# Altium project 一体机V5.PrjPcb (part 1 of 4)
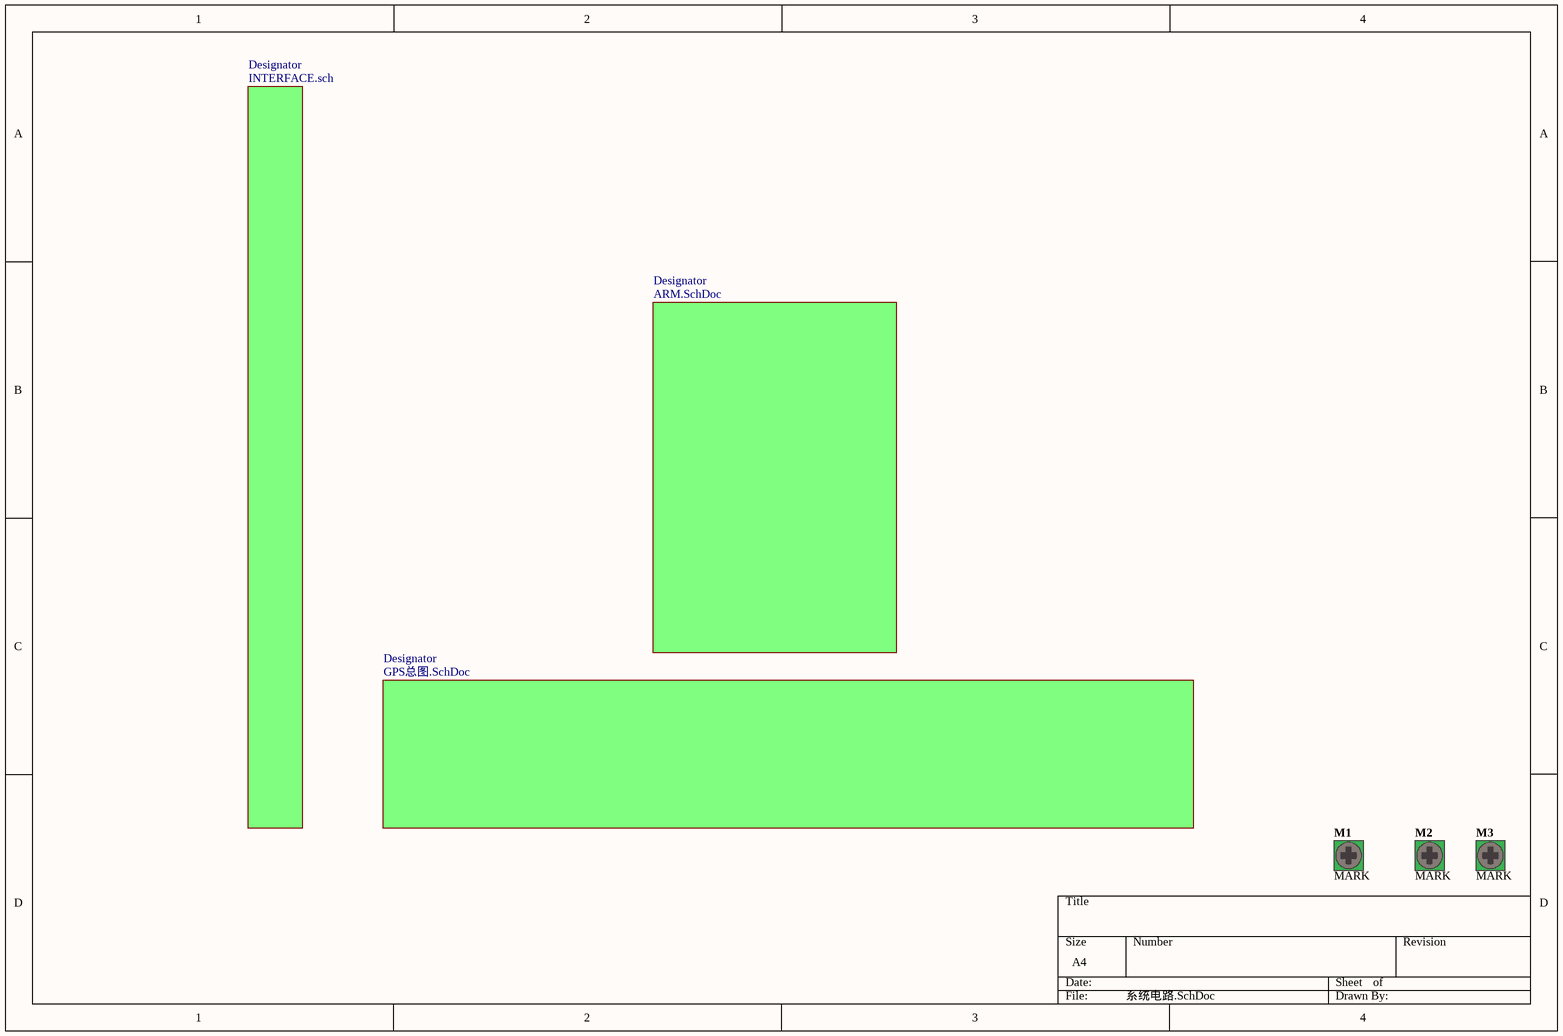
[diagram p0: 系统电路.SchDoc]
24 sheets, 290 parts. Net scope: global (net labels, ports and power ports of the same name join across sheets).
Board file: PCB5.PcbDoc
Sheets:
  系统电路.SchDoc
    Designator = ARM.SchDoc
      Designator = 电源ARM_LP5951_1.3.SchDoc
      Designator = 06-JTAG.SchDoc
      Designator = 05-RESET.SchDoc
      Designator = 电源ARM_VRD240512MP-8W.SchDoc
      Designator = 外围电路.SchDoc
        Designator = 12-LCD背光驱动_BIT3251.SchDoc
        Designator = 04-蜂鸣器.SchDoc
        Designator = 05-RTC.SchDoc
        Designator = 03-指示灯.SchDoc
        Designator = 07-LVDS.SchDoc
        Designator = 01-USB Device.SchDoc
        Designator = 06-Key.SchDoc
        Designator = 08-IIC.SchDoc
        Designator = 11-SPI.SchDoc
    Designator = GPS总图.SchDoc
      Designator = 01-MSP430.SchDoc
      Designator = 02-GPRS.SchDoc
      Designator = 03-GPS.SchDoc
      Designator = BQ24073_锂电池充电.SchDoc
      Designator = 开盒检测_MAX931.SchDoc
      Designator = MAIN POWER.SchDoc
      Designator = 上电唤醒_Max706.SchDoc

## Sheet 系统电路.SchDoc
size A4; DocumentNumber: 1; SheetNumber: 1; SheetTotal: 34

### Parts
M1  MARK  [Mark]  (no BOM)
M2  MARK  [Mark]  (no BOM)
M3  MARK  [Mark]  (no BOM)

### Sub-sheets
Designator = ARM.SchDoc: no entries
Designator = GPS总图.SchDoc: no entries
Designator = INTERFACE.sch (file not in this document): no entries

### Nets

Not connected (* = marked no-connect by the designer): M1 1; M2 1; M3 1

### Library data of the parts
M1-M3 = D-001-0001: Mounting Hole, M3 Screw, Plated, Square Pad; Status: Production; Category: Mounting-Hole

## Sheet ARM.SchDoc
size A4; DocumentNumber: 12; SheetNumber: 12; SheetTotal: 34
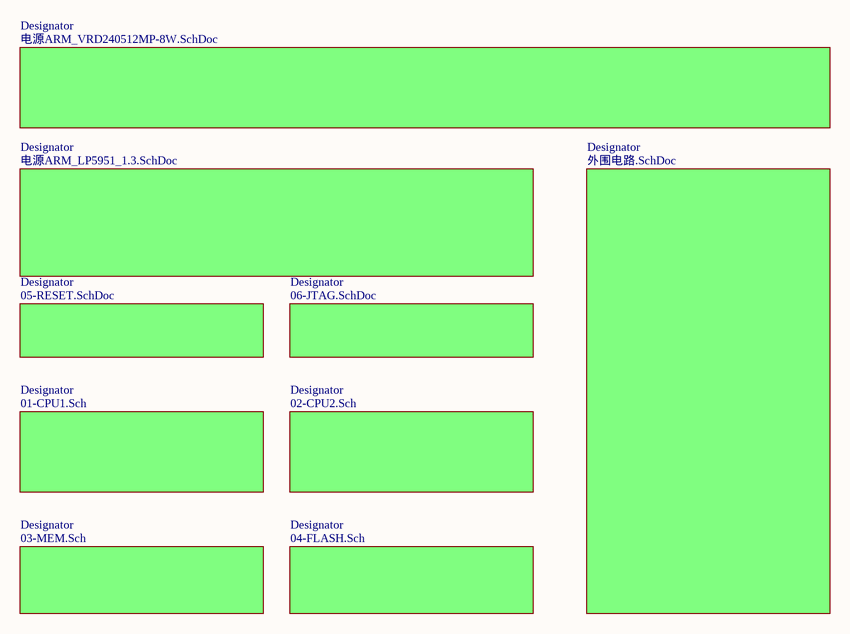
[diagram p1: ARM.SchDoc]

### Sub-sheets
Designator = 01-CPU1.Sch (file not in this document): no entries
Designator = 02-CPU2.Sch (file not in this document): no entries
Designator = 03-MEM.Sch (file not in this document): no entries
Designator = 04-FLASH.Sch (file not in this document): no entries
Designator = 电源ARM_LP5951_1.3.SchDoc: no entries
Designator = 06-JTAG.SchDoc: no entries
Designator = 05-RESET.SchDoc: no entries
Designator = 电源ARM_VRD240512MP-8W.SchDoc: no entries
Designator = 外围电路.SchDoc: no entries

## Sheet 电源ARM_LP5951_1.3.SchDoc
size A4
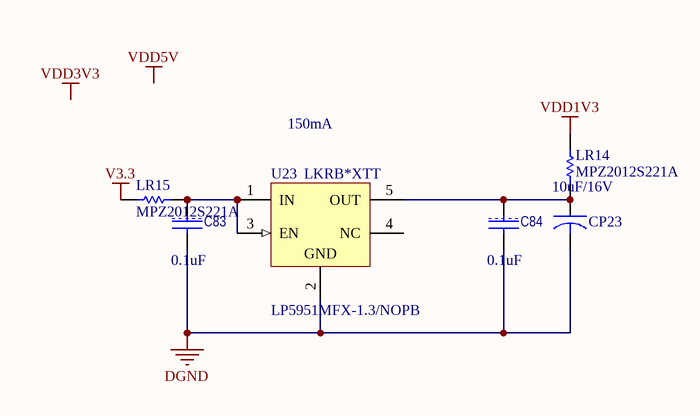
[diagram p2: 电源ARM_LP5951_1.3.SchDoc]

### Parts
C83  value 0.1uF  [1608[0603]C]  (hidden comment: C1608X7R1H104K)
C84  value 0.1uF  [1608[0603]C]  (hidden comment: C1608X7R1H104K)
CP23  value 10uF/16V  [3216[1206]CB]  (hidden comment: TAJA106K016RNJ)
LR14  MPZ2012S221A  [2012[0805]]
LR15  MPZ2012S221A  [2012[0805]]
U23  LP5951MFX-1.3/NOPB  PackageTopMarking: LKRB*XTT  [MF05A_N]

### Nets
DGND: C83.2 C84.2 CP23.2 U23.2(GND)
V3.3: LR15.2
VDD1V3: LR14.2
NetC83_1: C83.1 LR15.1 U23.1(IN) U23.3(EN)
NetC84_1: C84.1 CP23.1 LR14.1 U23.5(OUT)

Not connected (* = marked no-connect by the designer): U23 4(NC)

### Notes on the sheet
- 150mA
- Labels drawn without touching a wire or pin: VDD3V3, VDD5V

### Library data of the parts
C83 C84 = CAP: 多层陶瓷电容器MLCC - SMD/SMT 0603 0.1uF 50volts X7R 10%; Manufacturer: TDK; 产品: General Type MLCCs; 产品种类: Low & Medium Capacitance SMD Ceramic Chip Capacitors; 外壳代码 - in: 0603; 外壳代码 - mm: 1608; 封装 / 箱体: 0603 (1608 metric); 封装: Reel; 尺寸: 0.8 mm W x 1.6 mm L x 0.8 mm H; 工作温度范围: - 55 C to + 125 C; 标准包装数量: 4000; 电压额定值: 50 V; 电容-nF: 100 nF; 电容-pF: 100000 pF; 系列: C; Category: 多层陶瓷电容器MLCC - SMD/SMT; ComponentLink1Description: http://www.tdk.com/pdf/general_B11.pdf; ComponentLink1URL: http://www.tdk.com/pdf/general_B11.pdf; Description 1: 多层陶瓷电容器MLCC - SMD/SMT 0603 0.1uF 50volts X7R 10%; Manufacturer Part Number: C1608X7R1H104K; Minimum Order Quantity: 1; Pricing 1: 1=0.160, 50=0.070, 100=0.036, 500=0.019, 1000=0.013, 4000=0.010, 8000=0.009, 12000=0.008, 20000=0.007 (USD); Reeling: True; RoHS - 贸泽: Y; RoHS: RoHS Compliant; Stock 1: 224604; Supplier 1: Mouser; Supplier Part Number 1: 810-C1608X7R1H104K; 制造商: TDK; 容差: 10 %; 温度系数/代码: X7R; 电容: 0.1 uF; 端接类型: SMD/SMT
CP23 = CAPACITOR: 钽质电容器-固体SMD 16volts 10uF 10%; Manufacturer: AVX; ESR: 3 Ohms; 产品: Tantalum Solid Standard Grade - Other Various; 产品种类: SMD Tantalum Capacitors; 制造商库存号: A Case; 外壳代码 - in: 1206; 外壳代码 - mm: 3216; 封装 / 箱体: 1206 (3216 metric); 封装: Reel; 尺寸: 1.6 mm W x 3.2 mm L; 工作温度范围: - 55 C to + 125 C; 损耗因数 DF: 8; 标准包装数量: 2000; 漏泄电流: 1.6 uA; 电压额定值: 16 V; 端接类型: SMD/SMT; 系列: TAJ; 高度: 1.8 mm; Category: 钽质电容器-固体SMD; ComponentLink1Description: http://www.avx.com/docs/Catalogs/taj.pdf; ComponentLink1URL: http://www.avx.com/docs/Catalogs/taj.pdf; Description 1: 钽质电容器-固体SMD 16volts 10uF 10%; Manufacturer Part Number: TAJA106K016RNJ; Minimum Order Quantity: 1; Pricing 1: 1=0.600, 100=0.280, 200=0.250, 500=0.221, 1000=0.200, 2000=0.140, 5000=0.131, 10000=0.124, 25000=0.103 (USD); Reeling: True; RoHS - 贸泽: Y; RoHS: RoHS Compliant; Stock 1: 20335; Supplier 1: Mouser; Supplier Part Number 1: 581-TAJA106K016R; 制造商: AVX; 容差: 10 %; 电容: 10 uF
LR14 LR15 = Res Semi: 电磁干扰滤波珠子、扼流圈和阵列 Ferrite Chip Beads; Manufacturer: TDK; 阻抗: 220 Ohms; 最大直流电流: 3 A; 最大直流电阻: 0.04 Ohms; 工作温度范围: - 55 C to + 125 C; 封装 / 箱体: 2012; 封装: Reel; 端接类型: SMD/SMT; 容差: 25 %; 产品种类: Ferrite Beads; 标准包装数量: 4000; Supplier 1: Mouser; Supplier Part Number 1: 810-MPZ2012S221A; Manufacturer Part Number: MPZ2012S221A; RoHS: RoHS Compliant; Description 1: 电磁干扰滤波珠子、扼流圈和阵列 Ferrite Chip Beads; Category: 电磁干扰滤波珠子、扼流圈和阵列; Stock 1: 26540; Pricing 1: 1=0.070, 50=0.060, 100=0.053, 500=0.040, 1000=0.035, 4000=0.031, 8000=0.029, 12000=0.025 (USD); 制造商: TDK; RoHS - 贸泽: Y; Minimum Order Quantity: 1; Reeling: True; ComponentLink1URL: http://www.mouser.com/ds/2/400/e9413_mpz-24582.pdf; ComponentLink1Description: http://www.mouser.com/ds/2/400/e9413_mpz-24582.pdf
U23 = LP5951MFX-1.3/NOPB: Micropower, 150mA Low-Dropout CMOS Voltage Regulator, 5-pin SOT-23, Pb-Free; Manufacturer: National Semiconductor; PowerWise: N; CompType: LDO IC; Published: 1-Mar-2010; DatasheetVersion: May-2007; PackageVersion: revD, Aug-2008; PackageReference: MF05A; Publisher: Altium Limited; PackageDescription: Molded SOT-23, .115 x .063 x .040 in Body, 5 Lead, .0375 in Pitch; Supplier 1: Digi-Key; Supplier Part Number 1: LP5951MFX-1.3-ND; PartNumber: LP5951MFX-1.3/NOPB; RoHS: Y; PinCount: 5; ComponentLink1Description: LP5951 Datasheet; ComponentLink1URL: http://www.national.com/ds/LP/LP5951.pdf; ComponentLink2Description: LP5951 Web Page; ComponentLink2URL: http://www.national.com/pf/LP/LP5951.html; ComponentLink3Description: MF05A Package Page; ComponentLink3URL: http://www.national.com/packaging/folders/mf05a.html

## Sheet 06-JTAG.SchDoc
size A4; DocumentNumber: 13; SheetNumber: 13; SheetTotal: 34
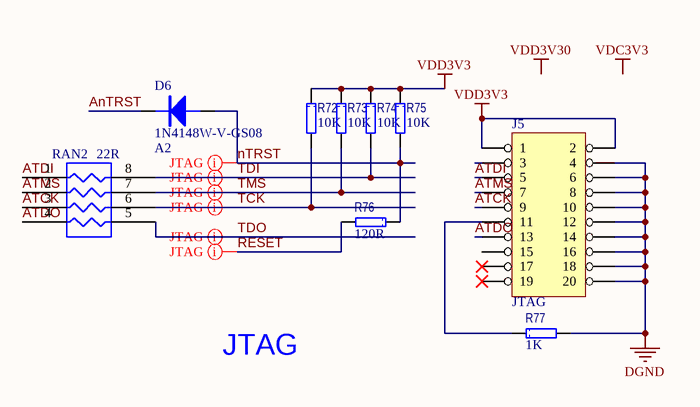
[diagram p3: 06-JTAG.SchDoc]

### Parts
D6  1N4148W-V-GS08  value A2  [SOD123]
J5  JTAG  [IDC20S]
R72  value 10K  [1608[0603]R]  (hidden comment: CRCW060310K0FKEA)
R73  value 10K  [1608[0603]R]  (hidden comment: CRCW060310K0FKEA)
R74  value 10K  [1608[0603]R]  (hidden comment: CRCW060310K0FKEA)
R75  value 10K  [1608[0603]R]  (hidden comment: CRCW060310K0FKEA)
R76  value 120R  [1608[0603]R]  (hidden comment: CRCW0603120RFKEA)
R77  value 1K  [1608[0603]R]  (hidden comment: CRCW06031K00FKEA)
RAN2  value 22R  [R-AR4]  (hidden comment: CRA06S08322R0JTA)

### Nets
DGND: J5.4 J5.6 J5.8 J5.10 J5.12 J5.14 J5.16 J5.18 J5.20 R77.2
VDD3V3: J5.1 J5.2 R72.1 R73.1 R74.1 R75.1  [also labelled VDD3V30]
AnTRST: D6.2(K)
ATCK: J5.9 RAN2.3(R3)
ATDI: J5.5 RAN2.1(R1)
ATDO: J5.13 RAN2.4(R4)
ATMS: J5.7 RAN2.2(R2)
nTRST: D6.1(A) R75.2 R76.1
RESET: R76.2  [project net nRESET]
TCK: R72.2 RAN2.6(R3)
TDI: R74.2 RAN2.8(R1)
TDO: RAN2.5(R4)
TMS: R73.2 RAN2.7(R2)
NetJ5_11: J5.11 R77.1

Not connected (* = marked no-connect by the designer): J5 3 15 17* 19*

### Layout directives
net class JTAG: nRESET, nTRST, TCK, TDI, TDO, TMS

### Notes on the sheet
- JTAG
- Labels drawn without touching a wire or pin: VDC3V3, VDD3V30

### Library data of the parts
D6 = 1N4148W: 二极管 - 通用，功率，开关 100V Io/150mA; Manufacturer: Vishay Semiconductors; 配置: Single; 工作温度范围: - 65 C to + 150 C; 封装 / 箱体: SOD-123; 封装: Reel; 产品: Switching Diodes; 正向连续电流: 0.15 A; 最大浪涌电流: 0.5 A; 安装风格: SMD/SMT; 恢复时间: 4 ns; 正向电压下降: 1.2 V; 制造商: Vishay; 最大二极管电容: 4 pF; 最大工作温度: + 150 C; 最大功率耗散: 350 mW; 最大反向漏泄电流: 5 uA; 最小工作温度: - 65 C; 标准包装数量: 15000; Supplier 1: Mouser; Supplier Part Number 1: 625-1N4148W-V; Manufacturer Part Number: 1N4148W-V-GS08; RoHS: RoHS Compliant; Category: 二极管 - 通用，功率，开关; Stock 1: 404148; Pricing 1: 1=0.090, 10=0.083, 50=0.072, 100=0.068, 500=0.032, 1000=0.026, 3000=0.021, 9000=0.016, 10000=0.016, 18000=0.014 (USD); 峰值反向电压: 100 V; 产品种类: Switching Diodes; RoHS - 贸泽: Y; Minimum Order Quantity: 1; Reeling: True; ComponentLink1URL: http://www.mouser.com/ds/2/427/1n4148w--240387.pdf; ComponentLink1Description: http://www.mouser.com/ds/2/427/1n4148w--240387.pdf; Description 1: 二极管 - 通用，功率，开关 100V Io/150mA
J5 = HEADER 10X2: 插针 CON
R72-R75 = RES: 厚膜电阻器 - SMD 1/10watt 10Kohms 1%; Manufacturer: Vishay / Dale; 尺寸: 0.85 mm W x 1.55 mm L x 0.45 mm H; 工作温度范围: - 55 C to + 155 C; 封装 / 箱体: 0603 (1608 metric); 封装: Reel; 功率额定值: 100 mW; 产品: Thick Film Resistors SMD; 系列: CRCW; 温度系数: 100 PPM / K; 端接类型: SMD/SMT; 电压额定值: 75 V; 制造商: Vishay; 产品种类: 0603 Thick Film Chip Resistors; 标准包装数量: 5000; 外壳代码 - in: 0603; 外壳代码 - mm: 1608; Supplier 1: Mouser; Supplier Part Number 1: 71-CRCW0603-10K-E3; Manufacturer Part Number: CRCW060310K0FKEA; RoHS: RoHS Compliant By Exemption; Category: 厚膜电阻器 - SMD; Stock 1: 0; Pricing 1: 1=0.080, 10=0.013, 100=0.010, 1000=0.008, 5000=0.005, 25000=0.004, 50000=0.003 (USD); 电阻: 10 kOhms; 容差: 1 %; RoHS - 贸泽: E; Minimum Order Quantity: 1; Reeling: True; ComponentLink1URL: http://www.mouser.com/ds/2/427/dcrcwe3-109170.pdf; ComponentLink1Description: http://www.mouser.com/ds/2/427/dcrcwe3-109170.pdf; Description 1: 厚膜电阻器 - SMD 1/10watt 10Kohms 1%
R76 = RES: 厚膜电阻器 - SMD 1/10watt 120ohms 1%; Manufacturer: Vishay / Dale; 尺寸: 0.85 mm W x 1.55 mm L x 0.45 mm H; 工作温度范围: - 55 C to + 155 C; 封装 / 箱体: 0603 (1608 metric); 封装: Reel; 功率额定值: 100 mW; 产品: Thick Film Resistors SMD; 系列: CRCW; 温度系数: 100 PPM / K; 端接类型: SMD/SMT; 电压额定值: 75 V; 外壳代码 - in: 0603; 外壳代码 - mm: 1608; 制造商: Vishay; 产品种类: 0603 Thick Film Chip Resistors; 标准包装数量: 5000; Supplier 1: Mouser; Supplier Part Number 1: 71-CRCW0603-120-E3; Manufacturer Part Number: CRCW0603120RFKEA; RoHS: RoHS Compliant By Exemption; Category: 厚膜电阻器 - SMD; Stock 1: 11148; Pricing 1: 1=0.080, 10=0.013, 100=0.010, 1000=0.008, 5000=0.005, 25000=0.004, 50000=0.003 (USD); 电阻: 120 Ohms; 容差: 1 %; RoHS - 贸泽: E; Minimum Order Quantity: 1; Reeling: True; ComponentLink1URL: http://www.mouser.com/ds/2/427/dcrcwe3-109170.pdf; ComponentLink1Description: http://www.mouser.com/ds/2/427/dcrcwe3-109170.pdf; Description 1: 厚膜电阻器 - SMD 1/10watt 120ohms 1%
R77 = RES: 厚膜电阻器 - SMD 1/10watt 1.0Kohms 1%; Manufacturer: Vishay / Dale; 尺寸: 0.85 mm W x 1.55 mm L x 0.45 mm H; 工作温度范围: - 55 C to + 155 C; 封装 / 箱体: 0603 (1608 metric); 封装: Reel; 功率额定值: 100 mW; 产品: Thick Film Resistors SMD; 电阻: 1 kOhms; 系列: CRCW; 温度系数: 100 PPM / K; 端接类型: SMD/SMT; 电压额定值: 75 V; 制造商: Vishay; 产品种类: 0603 Thick Film Chip Resistors; 标准包装数量: 5000; 外壳代码 - in: 0603; 外壳代码 - mm: 1608; Supplier 1: Mouser; Supplier Part Number 1: 71-CRCW0603-1.0K-E3; Manufacturer Part Number: CRCW06031K00FKEA; RoHS: RoHS Compliant By Exemption; Category: 厚膜电阻器 - SMD; Stock 1: 276938; Pricing 1: 1=0.080, 10=0.013, 100=0.010, 1000=0.008, 5000=0.005, 25000=0.004, 50000=0.003 (USD); 容差: 1 %; RoHS - 贸泽: E; Minimum Order Quantity: 1; Reeling: True; ComponentLink1URL: http://www.mouser.com/ds/2/427/dcrcwe3-109170.pdf; ComponentLink1Description: http://www.mouser.com/ds/2/427/dcrcwe3-109170.pdf; Description 1: 厚膜电阻器 - SMD 1/10watt 1.0Kohms 1%
RAN2 = RP4R: 电阻器网络与阵列 8Term 22ohms 5% Convex; Manufacturer: Vishay / Dale; 尺寸: 1.5 mm W x 1.6 mm L x 0.5 mm H; 工作温度范围: - 55 C to + 150 C; 封装: Reel; 系列: CRA06; 温度系数: 200 PPM / K; 端接类型: SMD/SMT; 电路类型: Isolated; 管脚数量: 8; 电阻器数量: 4; 引线间隔: 0.8 mm; 制造商: Vishay; 产品种类: Thick Film Resistor Arrays; 产品类型: Arrays; Supplier 1: Mouser; Supplier Part Number 1: 71-CRA06S08322R0JTA; Manufacturer Part Number: CRA06S08322R0JTA; RoHS: RoHS Compliant By Exemption; Description 1: 电阻器网络与阵列 8Term 22ohms 5% Convex; Category: 电阻器网络与阵列; Stock 1: 1674; Pricing 1: 1=0.090, 100=0.080, 500=0.070, 1000=0.056, 5000=0.051, 10000=0.050, 25000=0.044 (USD); 容差: 5 %; 电阻数值: 22 Ohms; RoHS - 贸泽: E; Minimum Order Quantity: 1; Reeling: True; ComponentLink1URL: http://www.mouser.com/ds/2/427/cra06es-73101.pdf; ComponentLink1Description: http://www.mouser.com/ds/2/427/cra06es-73101.pdf

## Sheet 05-RESET.SchDoc
size A4; DocumentNumber: 14; SheetNumber: 14; SheetTotal: 34
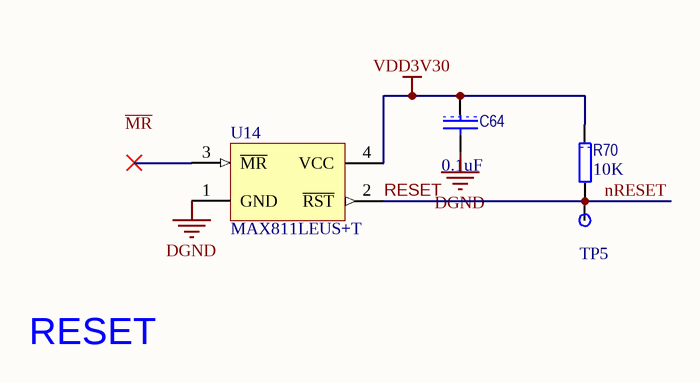
[diagram p4: 05-RESET.SchDoc]

### Parts
C64  value 0.1uF  [1608[0603]C]  (hidden comment: C1608X7R1H104K)
R70  value 10K  [1608[0603]R]  (hidden comment: CRCW060310K0FKEA)
TP5  TP  [TP]  (value not drawn)
U14  MAX811LEUS+T  [SOT143_N]

### Nets
DGND: C64.2 U14.1(GND)
VDD3V30: C64.1 R70.1 U14.4(VCC)  [project net VDD3V3]
nRESET: R70.2 TP5.1(TestPoint) U14.2(~{RST})  [also labelled RESET]

Not connected (* = marked no-connect by the designer): U14 3(~{MR})*

### Notes on the sheet
- RESET
- Labels drawn without touching a wire or pin: ~{MR}

### Library data of the parts
C64 = CAP: as C83 on sheet 电源ARM_LP5951_1.3; Category: 多层陶瓷电容器MLCC - SMD/SMT; ComponentLink1Description: http://www.tdk.com/pdf/general_B11.pdf; ComponentLink1URL: http://www.tdk.com/pdf/general_B11.pdf; Description 1: 多层陶瓷电容器MLCC - SMD/SMT 0603 0.1uF 50volts X7R 10%; Manufacturer Part Number: C1608X7R1H104K; Minimum Order Quantity: 1; Pricing 1: 1=0.160, 50=0.070, 100=0.036, 500=0.019, 1000=0.013, 4000=0.010, 8000=0.009, 12000=0.008, 20000=0.007 (USD); Reeling: True; RoHS - 贸泽: Y; RoHS: RoHS Compliant; Stock 1: 224604; Supplier 1: Mouser; Supplier Part Number 1: 810-C1608X7R1H104K; 制造商: TDK; 容差: 10 %; 温度系数/代码: X7R; 电容: 0.1 uF; 端接类型: SMD/SMT
R70 = RES: as R72 on sheet 06-JTAG; Supplier 1: Mouser; Supplier Part Number 1: 71-CRCW0603-10K-E3; Manufacturer Part Number: CRCW060310K0FKEA; RoHS: RoHS Compliant By Exemption; Category: 厚膜电阻器 - SMD; Stock 1: 0; Pricing 1: 1=0.080, 10=0.013, 100=0.010, 1000=0.008, 5000=0.005, 25000=0.004, 50000=0.003 (USD); 电阻: 10 kOhms; 容差: 1 %; RoHS - 贸泽: E; Minimum Order Quantity: 1; Reeling: True; ComponentLink1URL: http://www.mouser.com/ds/2/427/dcrcwe3-109170.pdf; ComponentLink1Description: http://www.mouser.com/ds/2/427/dcrcwe3-109170.pdf; Description 1: 厚膜电阻器 - SMD 1/10watt 10Kohms 1%
TP5 = Test Point
U14 = MAX811-EUS-T: 监控电路 4-Pin uPower Voltage Monitor; Manufacturer: Maxim Integrated; 输出类型: Active Low, Push-Pull; 封装 / 箱体: SOT-143; 封装: Cut Tape; 系列: MAX811; 人工复位: Not Resettable; 监测电压数: 1; 过电压阈值: 4.72 V; 上电复位延迟（典型值）: 560 ms; 电源电流（典型值）: 6 uA; 欠电压阈值: 4.54 V; 监视器: No Watchdog; 电池备用开关: No Backup; 芯片启用信号: No; 最大工作温度: + 85 C; 最大功率耗散: 320 mW; 最小工作温度: - 40 C; 监测电压: 3 V, 3.3 V, 5 V; 电源电压-最小: 1.2 V; Supplier 1: Mouser; Supplier Part Number 1: 700-MAX811LEUST; Manufacturer Part Number: MAX811LEUS+T; RoHS: RoHS Compliant; Description 1: 监控电路 4-Pin uPower Voltage Monitor; Category: 监控电路; Stock 1: 3290; Pricing 1: 1=2.24, 25=1.69, 50=1.59, 100=1.48, 250=1.46, 500=1.42 (USD); 制造商: Maxim Integrated; 功率失效检测: No; RoHS - 贸泽: Y; Minimum Order Quantity: 1; Reeling: False; ComponentLink1URL: http://www.mouser.com/ds/2/256/MAX811-MAX812-190465.pdf; ComponentLink1Description: http://www.mouser.com/ds/2/256/MAX811-MAX812-190465.pdf

## Sheet 电源ARM_VRD240512MP-8W.SchDoc
size A4; DocumentNumber: 11; SheetNumber: 11; SheetTotal: 34
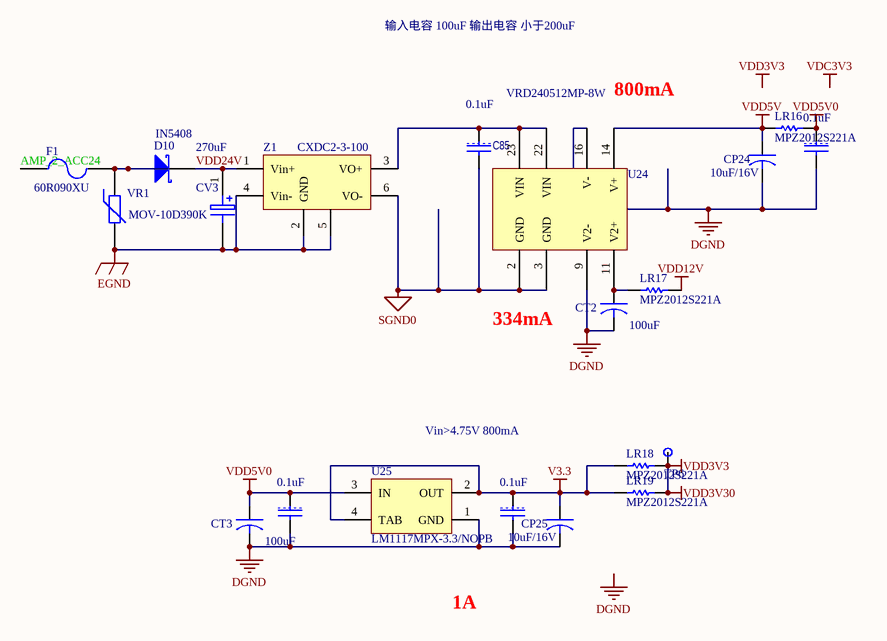
[diagram p5: 电源ARM_VRD240512MP-8W.SchDoc]

### Parts
C85  value 0.1uF  [1608[0603]C]  (hidden comment: C1608X7R1H104K)
C86  value 0.1uF  [1608[0603]C]  (hidden comment: C1608X7R1H104K)
C87  value 0.1uF  [1608[0603]C]  (hidden comment: C1608X7R1H104K)
C88  value 0.1uF  [1608[0603]C]  (hidden comment: C1608X7R1H104K)
CP24  10uF/16V  [3216[1206]CB]
CP25  10uF/16V  [3216[1206]CB]
CT2  value 100uF  [6032[2312]CC]  (hidden comment: TAJC107K016RNJ)
CT3  value 100uF  [6032[2312]CC]  (hidden comment: TAJC107K016RNJ)
CV3  value 270uF  [CAPPR5-10x20/H1.1]  (hidden comment: EEU-FM1H271)
D10  IN5408  [DO-214AB/SMC]
F1  60R090XU  [FUS-0.2]
LR16  MPZ2012S221A  [2012[0805]]
LR17  MPZ2012S221A  [2012[0805]]
LR18  MPZ2012S221A  [2012[0805]]
LR19  MPZ2012S221A  [2012[0805]]
TP6  TP  [TP]  (value not drawn)
U24  VRD240512MP-8W  [DIP-7(24)W]
U25  LM1117MPX-3.3/NOPB  [MP04A_N]
VR1  MOV-10D390K  [RAD-0.3]
Z1  CXDC2-3-100  [DIP-6(20)W]

### Nets
DGND: C86.2 C87.2 C88.2 CP24.2 CP25.2 CT2.2 CT3.2 U24.9(V2-) U24.16(V-) U25.1(GND)
EGND: CV3.2 VR1.2 Z1.2(GND) Z1.4(Vin-) Z1.5(GND)
SGND0: C85.2 U24.2(GND) U24.3(GND) Z1.6(VO-)
V3.3: C88.1 CP25.1 LR18.1 LR19.1 U25.2(OUT) U25.4(TAB)
VDD3V3: LR18.2 LR19.2 TP6.1(TestPoint)  [also labelled VDD3V30]
VDD5V: CP24.1 LR16.1 U24.14(V+)
VDD5V0: C86.1 C87.1 CT3.1 LR16.2 U25.3(IN)
VDD12V: LR17.2
AMP_2_ACC24: F1.1
VDD24V: CV3.1 D10.2(K) Z1.1(Vin+)
NetC85_1: C85.1 U24.22(VIN) U24.23(VIN) Z1.3(VO+)
NetCT2_1: CT2.1 LR17.1 U24.11(V2+)
NetD10_1: D10.1(A) F1.2 VR1.1

### Notes on the sheet
- 输入电容 100uF 输出电容 小于200uF
- 800mA
- 334mA
- Vin>4.75V 800mA
- 1A
- Labels drawn without touching a wire or pin: DGND, VDC3V3, VDD3V3

### Library data of the parts
C85-C88 = CAP: as C83 on sheet 电源ARM_LP5951_1.3; Supplier 1: Mouser; Supplier Part Number 1: 810-C1608X7R1H104K; Manufacturer Part Number: C1608X7R1H104K; RoHS: RoHS Compliant; Description 1: 多层陶瓷电容器MLCC - SMD/SMT 0603 0.1uF 50volts X7R 10%; Category: 多层陶瓷电容器MLCC - SMD/SMT; Stock 1: 224604; Pricing 1: 1=0.160, 50=0.070, 100=0.036, 500=0.019, 1000=0.013, 4000=0.010, 8000=0.009, 12000=0.008, 20000=0.007 (USD); ComponentLink1URL: http://www.tdk.com/pdf/general_B11.pdf; ComponentLink1Description: http://www.tdk.com/pdf/general_B11.pdf; Minimum Order Quantity: 1; Reeling: True; RoHS - 贸泽: Y; 制造商: TDK; 容差: 10 %; 温度系数/代码: X7R; 电容: 0.1 uF; 端接类型: SMD/SMT
CP24 CP25 = CAPACITOR: Tantalum Capacitor; Compy: TAJ; name: TAJ-A-106-M-010-R
CT2 CT3 = CAPACITOR: 钽质电容器-固体SMD 16V 100uF 10%; Manufacturer: AVX; 尺寸: 3.2 mm W x 6 mm L; 高度: 2.8 mm; 工作温度范围: - 55 C to + 125 C; 封装 / 箱体: 2412 (6032 metric); 封装: Reel; 产品: Tantalum Solid Standard Grade - Other Various; 系列: TAJ; 端接类型: SMD/SMT; ESR: 1 Ohms; 漏泄电流: 16 uA; 外壳代码 - in: 2412; 外壳代码 - mm: 6032; 损耗因数 DF: 8; 制造商库存号: C Case; 产品种类: SMD Tantalum Capacitors; 标准包装数量: 500; Supplier 1: Mouser; Supplier Part Number 1: 581-TAJC107K016RNJ; Manufacturer Part Number: TAJC107K016RNJ; RoHS: RoHS Compliant; Description 1: 钽质电容器-固体SMD 16V 100uF 10%; Category: 钽质电容器-固体SMD; Stock 1: 40; Pricing 1: 1=1.50, 50=0.930, 100=0.720, 500=0.540, 1000=0.480 (USD); 电容: 100 uF; 容差: 10 %; 电压额定值: 16 V; 制造商: AVX; RoHS - 贸泽: Y; Minimum Order Quantity: 1; Reeling: True; ComponentLink1URL: http://www.avx.com/docs/Catalogs/taj.pdf; ComponentLink1Description: http://www.avx.com/docs/Catalogs/taj.pdf
CV3 = ELECTRO1: 插针 铝质电解电容器 - 带引线 270UF 50V ELECT FM RADIAL; Manufacturer: Panasonic Electronic Components; 工作温度范围: - 40 C to + 105 C; 封装: Bulk; 产品: Low Impedance Electrolytic Capacitors; 容差: 20 %; 外壳直径: 10 mm; 外壳长度: 20 mm; 损耗因数 DF: 0.1; 引线间隔: 5 mm; 加载寿命: 5000 hr; 制造商: Panasonic; 纹波电流: 1890 mA; 标准包装数量: 200; Supplier 1: Mouser; Supplier Part Number 1: 667-EEU-FM1H271; Manufacturer Part Number: EEU-FM1H271; RoHS: RoHS Compliant; Description 1: 铝质电解电容器 - 带引线 270UF 50V ELECT FM RADIAL; Category: 铝质电解电容器 - 带引线; Stock 1: 264; Pricing 1: 1=0.370, 25=0.334, 100=0.305, 250=0.281, 500=0.246, 1000=0.226, 2000=0.216, 5000=0.200 (USD); 电容: 270 uF; 系列: FM; 端接类型: Radial; 电压额定值: 50 V; RoHS - 贸泽: Y; Minimum Order Quantity: 1; Reeling: False; ComponentLink1URL: http://www.mouser.com/ds/2/315/ABA0000CE108-5973.pdf; ComponentLink1Description: http://www.mouser.com/ds/2/315/ABA0000CE108-5973.pdf
D10 = D Schottky: 肖特基二极管与整流器 3.0 Amp 60 Volt; Manufacturer: Vishay Semiconductors; Manufacturer Part Number: SS36-E3/57T; 配置: Single; 工作温度范围: - 55 C to + 150 C; 封装 / 箱体: SMC (DO-214AB); 封装: Reel; 产品: Schottky Rectifiers; 正向连续电流: 3 A; 最大浪涌电流: 100 A; 安装风格: SMD/SMT; 正向电压下降: 0.75 V; 制造商: Vishay; 最大反向漏泄电流: 500 uA; 峰值反向电压: 60 V; 标准包装数量: 850; Supplier 1: Mouser; Supplier Part Number 1: 625-SS36-E3; RoHS: RoHS Compliant By Exemption; Description 1: 肖特基二极管与整流器 3.0 Amp 60 Volt; Category: 肖特基二极管与整流器; Stock 1: 481; Pricing 1: 1=0.280, 10=0.250, 100=0.188, 250=0.154, 500=0.144, 850=0.144, 1000=0.139, 2000=0.131 (USD); 产品种类: Schottky Rectifiers; RoHS - 贸泽: E; Minimum Order Quantity: 1; Reeling: True; ComponentLink1URL: http://www.mouser.com/ds/2/427/88751-106389.pdf; ComponentLink1Description: http://www.mouser.com/ds/2/427/88751-106389.pdf
F1 = Fuse 2: 插针 可复位保险丝 60V POLYFUSE .100A RADIAL LEADS; Manufacturer: Littelfuse; Manufacturer Part Number: 60R010XU; 电流额定值: 40 A; 尺寸: 12.7 mm L x 3.1 mm  H x 7.4 mm D; 工作温度范围: - 40 C to + 85 C; 封装: Bulk; 电阻: 7.5 Ohms; 系列: 60R; 类型: PolyFuse Resettable PTC; 保持电流: 0.1 A; 最大电压: 60 VDC; 安装风格: Through Hole; 跳闸电流: 0.2 A; 引线间隔: 5.1 mm; 产品种类: Resettable PTCs; 标准包装数量: 500; Supplier 1: Mouser; Supplier Part Number 1: 576-60R010XU; RoHS: RoHS Compliant; Description 1: 可复位保险丝 60V POLYFUSE .100A RADIAL LEADS; Category: 可复位保险丝; Stock 1: 3959; Pricing 1: 1=0.410, 10=0.341, 100=0.283, 250=0.258, 500=0.219, 1000=0.193, 2500=0.177, 5000=0.174, 10000=0.161 (USD); 端接类型: Radial; 电流额定值（最大值）: 40 A; 制造商: Littelfuse; 最大直流电压: 60 V; RoHS - 贸泽: Y; Minimum Order Quantity: 1; Reeling: False; ComponentLink1URL: http://www.mouser.com/ds/2/240/Littelfuse_60R-61724.pdf; ComponentLink1Description: http://www.mouser.com/ds/2/240/Littelfuse_60R-61724.pdf
LR16-LR19 = Res Semi: as LR14 on sheet 电源ARM_LP5951_1.3; Supplier 1: Mouser; Supplier Part Number 1: 810-MPZ2012S221A; Manufacturer Part Number: MPZ2012S221A; RoHS: RoHS Compliant; Description 1: 电磁干扰滤波珠子、扼流圈和阵列 Ferrite Chip Beads; Category: 电磁干扰滤波珠子、扼流圈和阵列; Stock 1: 26540; Pricing 1: 1=0.070, 50=0.060, 100=0.053, 500=0.040, 1000=0.035, 4000=0.031, 8000=0.029, 12000=0.025 (USD); 制造商: TDK; RoHS - 贸泽: Y; Minimum Order Quantity: 1; Reeling: True; ComponentLink1URL: http://www.mouser.com/ds/2/400/e9413_mpz-24582.pdf; ComponentLink1Description: http://www.mouser.com/ds/2/400/e9413_mpz-24582.pdf
TP6 = Test Point
U24 = VRD240512MP-8W: 插针VRD240512MP-8W 2:1 1500V 82%
U25 = LM1117MPX-3.3/NOPB: 800mA Low-Dropout Linear Regulator, 4-pin SOT-223, Pb-Free; Manufacturer: National Semiconductor; PackageTopMarking: XYTT*N05A; PowerWise: N; CompType: LDO IC; Published: 1-Mar-2010; DatasheetVersion: Apr-2006; PackageVersion: revB, Apr-2003; PackageReference: MP04A; Publisher: Altium Limited; PackageDescription: Molded SOT-223, 6.50 x 3.56 x 1.6mm Body, 4 Lead, 2.3mm Pitch; Supplier 1: Digi-Key; Supplier Part Number 1: LM1117MPX-3.3TR-ND; Supplier 2: Digi-Key; Supplier Part Number 2: LM1117MPX-3.3CT-ND; Supplier 3: Digi-Key; Supplier Part Number 3: LM1117MPX-3.3DKR-ND; PartNumber: LM1117MPX-3.3/NOPB; RoHS: Y; PinCount: 4; Code_JEDEC: TO-261-AA; Code_IPC: SOT223-4; ComponentLink1Description: LM1117 Datasheet; ComponentLink1URL: http://www.national.com/ds/LM/LM1117.pdf; ComponentLink2Description: LM1117 Web Page; ComponentLink2URL: http://www.national.com/pf/LM/LM1117.html; ComponentLink3Description: MP04A Package Page; ComponentLink3URL: http://www.national.com/packaging/folders/mp04a.html
VR1 = Res Varistor: 插针 压敏电阻 500A 39volts 10%; Manufacturer: Bourns; Description 1: 压敏电阻 2400pF 39volts 10%; 电容: 2400 pF; 钳位电压: 77 V; 直径: 10 mm; 尺寸: 12.5 mm Dia. x 7.2 mm W; 安装: Radial; 工作温度范围: - 40 C to + 85 C; 封装: Bulk; 浪涌能量额定值: 4.6 J; 电压额定值 DC: 43 V; 外壳直径: 12.5 mm; 外壳宽度: 7.2 mm; Supplier 1: Mouser; Supplier Part Number 1: 652-MOV-10D390K; Manufacturer Part Number: MOV-10D390K; RoHS: RoHS Compliant; Category: 压敏电阻; Stock 1: 13078; Pricing 1: 1=0.200, 10=0.165, 100=0.154, 250=0.137, 500=0.114, 1000=0.108, 5000=0.077, 10000=0.076 (USD); 容差: 10 %; 峰值浪涌电流: 500 A; 制造商: Bourns; RoHS - 贸泽: Y; Minimum Order Quantity: 1; Reeling: False; ComponentLink1URL: http://www.bourns.com/data/global/pdfs/MOV10D.pdf; ComponentLink1Description: http://www.bourns.com/data/global/pdfs/MOV10D.pdf; Supplier 2: Mouser; Supplier Part Number 2: 667-ERZ-V10D390
Z1 = CXDB: 插针 Filter; 公司: 中北创新

## Sheet 外围电路.SchDoc
size A4; DocumentNumber: 6; SheetNumber: 6; SheetTotal: 34
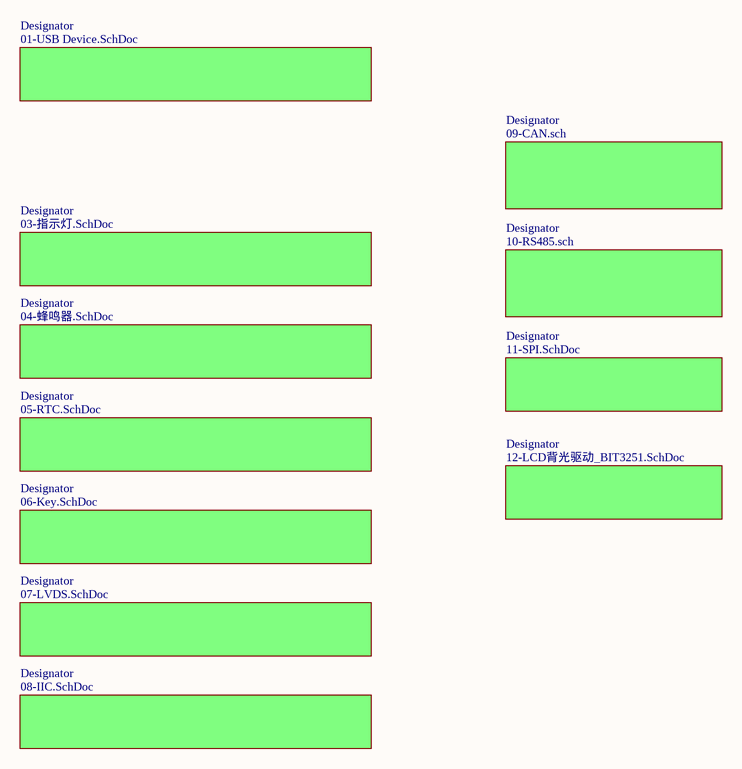
[diagram p6: 外围电路.SchDoc]

### Sub-sheets
Designator = 10-RS485.sch (file not in this document): no entries
Designator = 12-LCD背光驱动_BIT3251.SchDoc: no entries
Designator = 09-CAN.sch (file not in this document): no entries
Designator = 04-蜂鸣器.SchDoc: no entries
Designator = 05-RTC.SchDoc: no entries
Designator = 03-指示灯.SchDoc: no entries
Designator = 07-LVDS.SchDoc: no entries
Designator = 01-USB Device.SchDoc: no entries
Designator = 06-Key.SchDoc: no entries
Designator = 08-IIC.SchDoc: no entries
Designator = 11-SPI.SchDoc: no entries

## Sheet 12-LCD背光驱动_BIT3251.SchDoc
size A4; DocumentNumber: 31; SheetNumber: 31; SheetTotal: 34
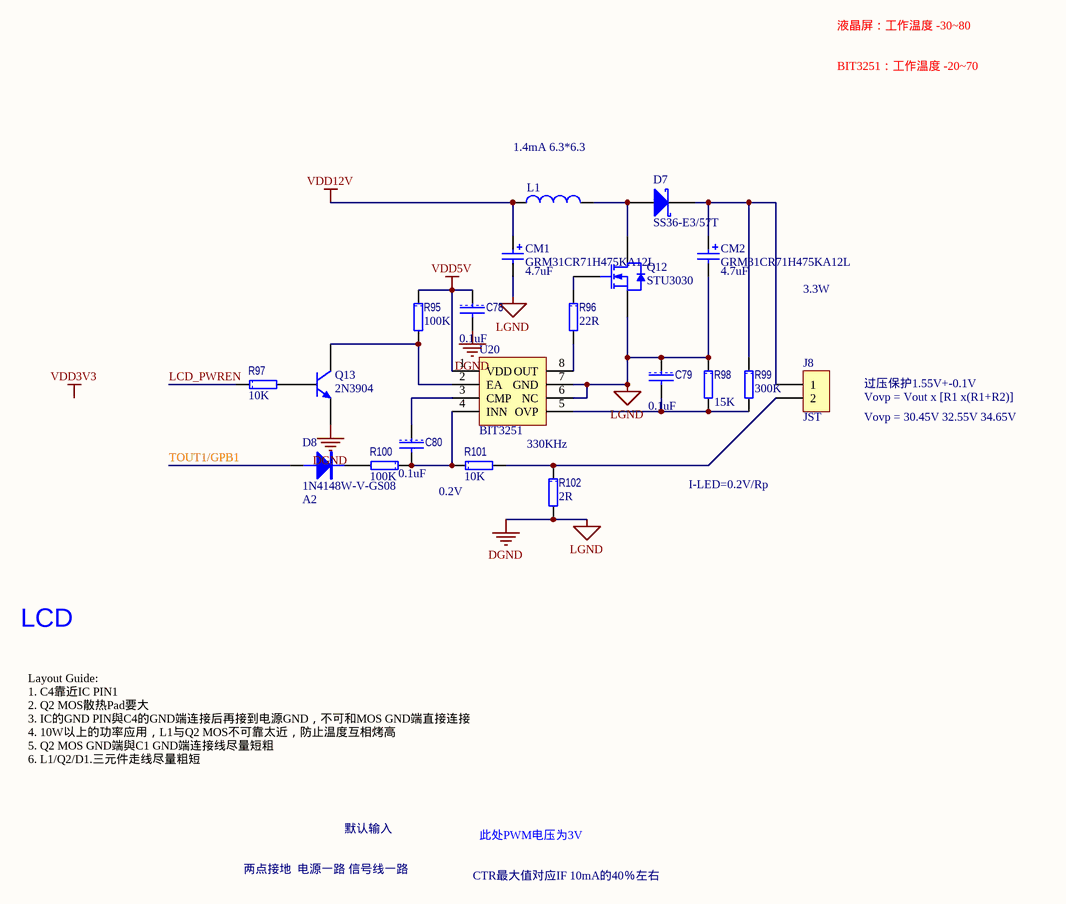
[diagram p7: 12-LCD背光驱动_BIT3251.SchDoc]

### Parts
C78  value 0.1uF  [1608[0603]C]  (hidden comment: C1608X7R1H104K)
C79  value 0.1uF  [1608[0603]C]  (hidden comment: C1608X7R1H104K)
C80  value 0.1uF  [1608[0603]C]  (hidden comment: C1608X7R1H104K)
CM1  GRM31CR71H475KA12L  value 4.7uF  [3216[1206]C]
CM2  GRM31CR71H475KA12L  value 4.7uF  [3216[1206]C]
D7  SS36-E3/57T  [DO-214AB/SMC]
D8  1N4148W-V-GS08  value A2  [SOD123]
J8  JST  [JST]
L1  SLF6045T-220M1R1-3PF  [INDP5050X28N]  (value not drawn)
Q12  STU3030  [TO-252AA_N]
Q13  2N3904  [SOT23_N]
R95  value 100K  [1608[0603]R]  (hidden comment: CRCW0603300KFKEA)
R96  value 22R  [1608[0603]R]  (hidden comment: CRCW060322R0FKEA)
R97  value 10K  [1608[0603]R]  (hidden comment: CRCW060310K0FKEA)
R98  value 15K  [1608[0603]R]  (hidden comment: CRCW060315K0FKEA)
R99  value 300K  [1608[0603]R]  (hidden comment: CRCW0603300KFKEA)
R100  value 100K  [1608[0603]R]  (hidden comment: CRCW0603300KFKEA)
R101  value 10K  [1608[0603]R]  (hidden comment: CRCW060310K0FKEA)
R102  value 2R  [1608[0603]R]  (hidden comment: CRCW06032R00FKEA)
U20  BIT3251  [SOIC8_N]

### Nets
DGND: C78.2 C79.1 CM1.2 CM2.2 Q12.3(S) Q13.1(E) R98.1 R102.2 U20.6(NC) U20.7(GND)  [also labelled LGND]
VDD5V: C78.1 R95.1 U20.1(VDD)
VDD12V: CM1.1 L1.1
LCD_PWREN: R97.1
TOUT1/GPB1: D8.1(A)
NetC79_2: C79.2 R98.2 R99.2 U20.5(OVP)
NetC80_1: C80.1 U20.3(CMP)
NetC80_2: C80.2 R100.1 R101.1 U20.4(INN)
NetCM2_1: CM2.1 D7.2(K) J8.1 R99.1
NetD7_1: D7.1(A) L1.2 Q12.4(D)
NetD8_2: D8.2(K) R100.2
NetJ8_2: J8.2 R101.2 R102.1
NetQ12_1: Q12.1(G) R96.1
NetQ13_2: Q13.2(B) R97.2
NetQ13_3: Q13.3(C) R95.2 U20.2(EA)
NetR96_2: R96.2 U20.8(OUT)

### Notes on the sheet
- 液晶屏：工作温度 -30~80
- BIT3251：工作温度 -20~70
- (near L1) 1.4mA 6.3*6.3
- 3.3W
- 过压保护1.55V+-0.1V
- 330KHz
- Vovp = 30.45V 32.55V 34.65V
- Vovp = Vout x [R1 x(R1+R2)]
- (near R101) 0.2V
- I-LED=0.2V/Rp
- LCD
- Layout Guide:
  1. C4靠近IC PIN1
  2. Q2 MOS散热Pad要大
  3. IC的GND PIN與C4的GND端连接后再接到电源GND，不可和MOS GND端直接连接
  4. 10W以上的功率应用，L1与Q2 MOS不可靠太近，防止温度互相烤高
  5. Q2 MOS GND端與C1 GND端连接线尽量短粗
  6. L1/Q2/D1.三元件走线尽量粗短
- 两点接地  电源一路 信号线一路
- 默认输入
- 此处PWM电压为3V
- CTR最大值对应IF 10mA的40％左右
- Labels drawn without touching a wire or pin: VDD3V3

### Library data of the parts
C78-C80 = CAP: 多层陶瓷电容器MLCC - SMD/SMT 0603 0.1uF 50volts X7R 10%; Manufacturer: TDK; 尺寸: 0.8 mm W x 1.6 mm L x 0.8 mm H; 工作温度范围: - 55 C to + 125 C; 封装 / 箱体: 0603 (1608 metric); 封装: Reel; 产品: General Type MLCCs; 系列: C; 电压额定值: 50 V; 电容-nF: 100 nF; 电容-pF: 100000 pF; 外壳代码 - in: 0603; 外壳代码 - mm: 1608; 产品种类: Low & Medium Capacitance SMD Ceramic Chip Capacitors; 标准包装数量: 4000; Supplier 1: Mouser; Supplier Part Number 1: 810-C1608X7R1H104K; Manufacturer Part Number: C1608X7R1H104K; RoHS: RoHS Compliant; Description 1: 多层陶瓷电容器MLCC - SMD/SMT 0603 0.1uF 50volts X7R 10%; Category: 多层陶瓷电容器MLCC - SMD/SMT; Stock 1: 224604; Pricing 1: 1=0.160, 50=0.070, 100=0.036, 500=0.019, 1000=0.013, 4000=0.010, 8000=0.009, 12000=0.008, 20000=0.007 (USD); 电容: 0.1 uF; 端接类型: SMD/SMT; 容差: 10 %; 制造商: TDK; 温度系数/代码: X7R; RoHS - 贸泽: Y; Minimum Order Quantity: 1; Reeling: True; ComponentLink1URL: http://www.tdk.com/pdf/general_B11.pdf; ComponentLink1Description: http://www.tdk.com/pdf/general_B11.pdf
CM1 CM2 = Cap Pol2: 多层陶瓷电容器MLCC - SMD/SMT 4.7uF 50Volts 10%; Manufacturer: Murata Electronics; 尺寸: 1.6 mm W x 3.2 mm L x 1.6 mm H; 工作温度范围: - 55 C to + 125 C; 封装 / 箱体: 1206 (3216 metric); 封装: Reel; 产品: General Type MLCCs; 系列: GRM; 电压额定值: 50 V; 电容-nF: 4700 nF; 外壳代码 - in: 1206; 外壳代码 - mm: 3216; 制造商: Murata; 标准包装数量: 2000; 温度系数/代码: X7R; Supplier 1: Mouser; Supplier Part Number 1: 81-GRM31CR71H475KA2L; Manufacturer Part Number: GRM31CR71H475KA12L; RoHS: RoHS Compliant; Description 1: 多层陶瓷电容器MLCC - SMD/SMT 4.7uF 50Volts 10%; Category: 多层陶瓷电容器MLCC - SMD/SMT; Stock 1: 57549; Pricing 1: 1=0.890, 10=0.561, 100=0.338, 1000=0.309, 2000=0.194, 10000=0.191, 24000=0.187, 50000=0.183 (USD); 电容: 4.7 uF; 端接类型: SMD/SMT; 容差: 10 %; RoHS - 贸泽: Y; Minimum Order Quantity: 1; Reeling: True; ComponentLink1URL: http://www.mouser.com/ds/2/281/product-244798.pdf; ComponentLink1Description: http://www.mouser.com/ds/2/281/product-244798.pdf
D7 = D Schottky: 肖特基二极管与整流器 3.0 Amp 60 Volt; Manufacturer: Vishay Semiconductors; 配置: Single; 工作温度范围: - 55 C to + 150 C; 封装 / 箱体: SMC (DO-214AB); 封装: Reel; 产品: Schottky Rectifiers; 正向连续电流: 3 A; 最大浪涌电流: 100 A; 安装风格: SMD/SMT; 正向电压下降: 0.75 V; 制造商: Vishay; 最大反向漏泄电流: 500 uA; 峰值反向电压: 60 V; 标准包装数量: 850; Supplier 1: Mouser; Supplier Part Number 1: 625-SS36-E3; Manufacturer Part Number: SS36-E3/57T; RoHS: RoHS Compliant By Exemption; Description 1: 肖特基二极管与整流器 3.0 Amp 60 Volt; Category: 肖特基二极管与整流器; Stock 1: 481; Pricing 1: 1=0.280, 10=0.250, 100=0.188, 250=0.154, 500=0.144, 850=0.144, 1000=0.139, 2000=0.131 (USD); 产品种类: Schottky Rectifiers; RoHS - 贸泽: E; Minimum Order Quantity: 1; Reeling: True; ComponentLink1URL: http://www.mouser.com/ds/2/427/88751-106389.pdf; ComponentLink1Description: http://www.mouser.com/ds/2/427/88751-106389.pdf
D8 = 1N4148W: as D6 on sheet 06-JTAG; Supplier 1: Mouser; Supplier Part Number 1: 625-1N4148W-V; Manufacturer Part Number: 1N4148W-V-GS08; RoHS: RoHS Compliant; Category: 二极管 - 通用，功率，开关; Stock 1: 404148; Pricing 1: 1=0.090, 10=0.083, 50=0.072, 100=0.068, 500=0.032, 1000=0.026, 3000=0.021, 9000=0.016, 10000=0.016, 18000=0.014 (USD); 峰值反向电压: 100 V; 产品种类: Switching Diodes; RoHS - 贸泽: Y; Minimum Order Quantity: 1; Reeling: True; ComponentLink1URL: http://www.mouser.com/ds/2/427/1n4148w--240387.pdf; ComponentLink1Description: http://www.mouser.com/ds/2/427/1n4148w--240387.pdf; Description 1: 二极管 - 通用，功率，开关 100V Io/150mA
J8 = CON2: CON
L1 = Inductor: 固定电感器 SMD Power Inductor
Q12 = BSN254: NMOS; Published: 17-Sep-2003; LatestRevisionDate: 12-Dec-2006; LatestRevisionNote: Footprint pad layout fixed.; DatasheetVersion: 19-Feb-2002; PackageVersion: Mar-1998; PackageReference: SOT54_variant; Publisher: Altium Limited; PackageDescription: Plastic single-ended leaded (through hole) package; 3 leads on-circle; Code_JEITA: SC-43; Code_JEDEC: TO-92 Variant; ComponentLink1Description: Manufacturer Link; ComponentLink1URL: http://www.semiconductors.philips.com/; ComponentLink2Description: Datasheet; ComponentLink2URL: http://www.semiconductors.philips.com/acrobat/datasheets/BSN254_BSN254A_3.pdf
Q13 = 2N3904: NPN General Purpose Amplifier; Published: 8-Jun-2000; LatestRevisionDate: 15-Jan-2003; LatestRevisionNote: PCB Footprint 'BCY-W3/D4.7' replaced; DatasheetVersion: 1997; PackageVersion: Sep-1998; PackageReference: TO-92A; Publisher: Altium Limited; PackageDescription: TO, Flat Index; 3 In-Line, Axial Leads; Body Dia. 4.5mm; Leads 0.51 x 0.48 mm (max); ComponentLink1Description: Manufacturer Link; ComponentLink1URL: http://www.fairchildsemi.com/; ComponentLink2Description: Datasheet; ComponentLink2URL: http://www.fairchildsemi.com/ds/2N%2F2N3904.pdf
R95 R99 R100 = RES: 厚膜电阻器 - SMD 1/10watt 300Kohms 1%; Manufacturer: Vishay / Dale; 尺寸: 0.85 mm W x 1.55 mm L x 0.45 mm H; 工作温度范围: - 55 C to + 155 C; 封装 / 箱体: 0603 (1608 metric); 封装: Reel; 功率额定值: 100 mW; 产品: Thick Film Resistors SMD; 系列: CRCW; 温度系数: 100 PPM / K; 端接类型: SMD/SMT; 电压额定值: 75 V; 外壳代码 - in: 0603; 外壳代码 - mm: 1608; 制造商: Vishay; 产品种类: 0603 Thick Film Chip Resistors; 标准包装数量: 5000; Supplier 1: Mouser; Supplier Part Number 1: 71-CRCW0603-300K-E3; Manufacturer Part Number: CRCW0603300KFKEA; RoHS: RoHS Compliant By Exemption; Category: 厚膜电阻器 - SMD; Stock 1: 19604; Pricing 1: 1=0.080, 10=0.013, 100=0.010, 1000=0.008, 5000=0.005, 25000=0.004, 50000=0.003 (USD); 电阻: 300 kOhms; 容差: 1 %; RoHS - 贸泽: E; Minimum Order Quantity: 1; Reeling: True; ComponentLink1URL: http://www.mouser.com/ds/2/427/dcrcwe3-109170.pdf; ComponentLink1Description: http://www.mouser.com/ds/2/427/dcrcwe3-109170.pdf; Description 1: 厚膜电阻器 - SMD 1/10watt 300Kohms 1%
R96 = RES: 厚膜电阻器 - SMD 1/10watt 22ohms 1%; Manufacturer: Vishay / Dale; 尺寸: 0.85 mm W x 1.55 mm L x 0.45 mm H; 工作温度范围: - 55 C to + 155 C; 封装 / 箱体: 0603 (1608 metric); 封装: Reel; 功率额定值: 100 mW; 产品: Thick Film Resistors SMD; 系列: CRCW; 温度系数: 100 PPM / K; 端接类型: SMD/SMT; 电压额定值: 75 V; 制造商: Vishay; 标准包装数量: 5000; 外壳代码 - in: 0603; 外壳代码 - mm: 1608; 产品种类: 0603 Thick Film Chip Resistors; Supplier 1: Mouser; Supplier Part Number 1: 71-CRCW0603-22-E3; Manufacturer Part Number: CRCW060322R0FKEA; RoHS: RoHS Compliant By Exemption; Category: 厚膜电阻器 - SMD; Stock 1: 35802; 电阻: 22 Ohms; 容差: 1 %; Minimum Order Quantity: 1; Reeling: True; ComponentLink1URL: http://www.mouser.com/ds/2/427/dcrcwe3-109170.pdf; ComponentLink1Description: http://www.mouser.com/ds/2/427/dcrcwe3-109170.pdf; Description 1: 厚膜电阻器 - SMD 1/10watt 22ohms 1%; Pricing 1: 1=0.080, 10=0.013, 100=0.010, 1000=0.008, 5000=0.005, 25000=0.004, 50000=0.003 (USD); RoHS - 贸泽: E
R97 R101 = RES: as R72 on sheet 06-JTAG; Supplier 1: Mouser; Supplier Part Number 1: 71-CRCW0603-10K-E3; Manufacturer Part Number: CRCW060310K0FKEA; RoHS: RoHS Compliant By Exemption; Category: 厚膜电阻器 - SMD; Stock 1: 0; Pricing 1: 1=0.080, 10=0.013, 100=0.010, 1000=0.008, 5000=0.005, 25000=0.004, 50000=0.003 (USD); 电阻: 10 kOhms; 容差: 1 %; RoHS - 贸泽: E; Minimum Order Quantity: 1; Reeling: True; ComponentLink1URL: http://www.mouser.com/ds/2/427/dcrcwe3-109170.pdf; ComponentLink1Description: http://www.mouser.com/ds/2/427/dcrcwe3-109170.pdf; Description 1: 厚膜电阻器 - SMD 1/10watt 10Kohms 1%
R98 = RES: 厚膜电阻器 - SMD 1/10watt 15Kohms 1%; Manufacturer: Vishay / Dale; 尺寸: 0.85 mm W x 1.55 mm L x 0.45 mm H; 工作温度范围: - 55 C to + 155 C; 封装 / 箱体: 0603 (1608 metric); 封装: Reel; 功率额定值: 100 mW; 产品: Thick Film Resistors SMD; 系列: CRCW; 温度系数: 100 PPM / K; 端接类型: SMD/SMT; 电压额定值: 75 V; 外壳代码 - in: 0603; 外壳代码 - mm: 1608; 制造商: Vishay; 产品种类: 0603 Thick Film Chip Resistors; 标准包装数量: 5000; Supplier 1: Mouser; Supplier Part Number 1: 71-CRCW0603-15K-E3; Manufacturer Part Number: CRCW060315K0FKEA; RoHS: RoHS Compliant By Exemption; Description 1: 厚膜电阻器 - SMD 1/10watt 15Kohms 1%; Category: 厚膜电阻器 - SMD; Stock 1: 75064; Pricing 1: 1=0.080, 10=0.013, 100=0.010, 1000=0.008, 5000=0.005, 25000=0.004, 50000=0.003 (USD); 电阻: 15 kOhms; 容差: 1 %; RoHS - 贸泽: E; Minimum Order Quantity: 1; Reeling: True; ComponentLink1URL: http://www.mouser.com/ds/2/427/dcrcwe3-109170.pdf; ComponentLink1Description: http://www.mouser.com/ds/2/427/dcrcwe3-109170.pdf
R102 = RES: 厚膜电阻器 - SMD 1/10watt 2ohms 1%; Manufacturer: Vishay / Dale; 尺寸: 0.85 mm W x 1.55 mm L x 0.45 mm H; 工作温度范围: - 55 C to + 155 C; 封装 / 箱体: 0603 (1608 metric); 封装: Reel; 功率额定值: 100 mW; 产品: Thick Film Resistors SMD; 系列: CRCW; 温度系数: 100 PPM / K; 端接类型: SMD/SMT; 电压额定值: 75 V; 外壳代码 - in: 0603; 外壳代码 - mm: 1608; 制造商: Vishay; 产品种类: 0603 Thick Film Chip Resistors; Product Status: New at Mouser; Supplier 1: Mouser; Supplier Part Number 1: 71-CRCW06032R00FKEA; Manufacturer Part Number: CRCW06032R00FKEA; RoHS: RoHS Compliant By Exemption; Category: 厚膜电阻器 - SMD; Stock 1: 9213; Pricing 1: 1=0.080, 10=0.013, 100=0.010, 1000=0.008, 5000=0.005, 25000=0.004, 50000=0.003 (USD); 电阻: 2 Ohms; 容差: 1 %; RoHS - 贸泽: E; Minimum Order Quantity: 1; Reeling: True; ComponentLink1URL: http://www.mouser.com/ds/2/427/dcrcwe3-109170.pdf; ComponentLink1Description: http://www.mouser.com/ds/2/427/dcrcwe3-109170.pdf; Description 1: 厚膜电阻器 - SMD 1/10watt 2ohms 1%
U20 = BIT3251: IC

## Sheet 04-蜂鸣器.SchDoc
size A4; DocumentNumber: 25; SheetNumber: 25; SheetTotal: 34
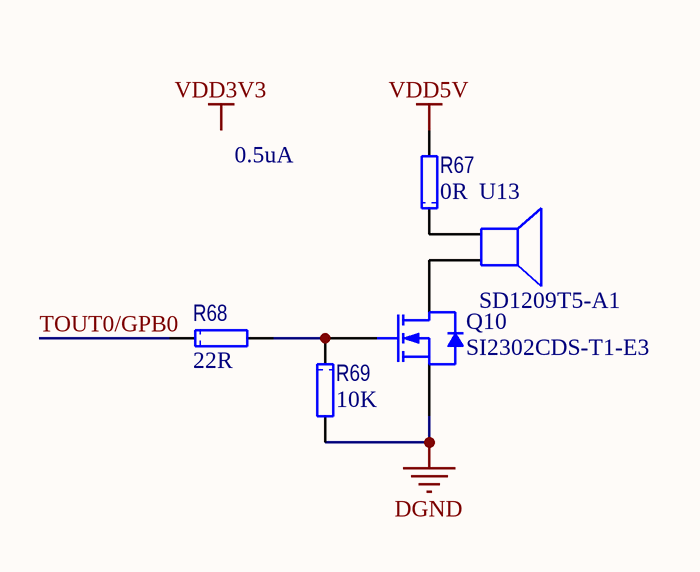
[diagram p8: 04-蜂鸣器.SchDoc]

### Parts
Q10  SI2302CDS-T1-E3  [SOT23_N]
R67  value 0R  [1608[0603]R]  (hidden comment: CRCW06030000ZSTA)
R68  value 22R  [1608[0603]R]  (hidden comment: CRCW060322R0FKEA)
R69  value 10K  [1608[0603]R]  (hidden comment: CRCW060310K0FKEA)
U13  SD1209T5-A1  [Speaker]

### Nets
DGND: Q10.2(S) R69.2
VDD5V: R67.2
TOUT0/GPB0: R68.1
NetQ10_1: Q10.1(G) R68.2 R69.1
NetQ10_3: Q10.3(D) U13.2
NetR67_1: R67.1 U13.1

### Notes on the sheet
- 0.5uA
- Labels drawn without touching a wire or pin: VDD3V3

### Library data of the parts
Q10 = 2N7002: MOSFET 20V 2.9A 0.86W 57mohm @ 4.5V; Manufacturer: Vishay / Siliconix; 配置: Single; 封装 / 箱体: SOT-23-3; 封装: Reel; 漏极连续电流: 2.6 A; 闸/源击穿电压: +/- 8 V; 安装风格: SMD/SMT; 功率耗散: 710 mW; 电阻汲极/源极 RDS（导通）: 0.057 Ohms; 晶体管极性: N-Channel; 下降时间: 7 ns; 制造商: Vishay; 最大工作温度: + 150 C; 最小工作温度: - 55 C; 产品种类: N-Channel MOSFETs; 标准包装数量: 3000; 典型关闭延迟时间: 30 ns; Supplier 1: Mouser; Supplier Part Number 1: 781-SI2302CDS-E3; Manufacturer Part Number: SI2302CDS-T1-E3; RoHS: RoHS Compliant; Description 1: MOSFET 20V 2.9A 0.86W 57mohm @ 4.5V; Category: MOSFET; Stock 1: 51301; Pricing 1: 1=0.150, 10=0.140, 100=0.130, 250=0.125, 500=0.120, 1000=0.115, 3000=0.110, 6000=0.105, 12000=0.100 (USD); 汲极/源极击穿电压: 20 V; 上升时间: 7 ns; RoHS - 贸泽: Y; Minimum Order Quantity: 1; Reeling: True; ComponentLink1URL: http://www.vishay.com/doc?68645; ComponentLink1Description: http://www.vishay.com/doc?68645
R67 = RES: 厚膜电阻器 - SMD 1/10watt ZEROohm Jumper; Manufacturer: Vishay / Dale; 尺寸: 0.85 mm W x 1.55 mm L x 0.45 mm H; 工作温度范围: - 55 C to + 155 C; 封装 / 箱体: 0603 (1608 metric); 封装: Reel; 功率额定值: 100 mW; 产品: Thick Film Resistors Zero-Ohm; 电阻: 0 Ohms; 系列: CRCW; 温度系数: 200 PPM / C; 端接类型: SMD/SMT; 容差: 1 %; 电压额定值: 75 V; 外壳代码 - in: 0603; 外壳代码 - mm: 1608; 制造商: Vishay; 产品种类: 0603 Thick Film Chip Resistors; 标准包装数量: 5000; Supplier 1: Mouser; Supplier Part Number 1: 71-CRCW0603-0; Manufacturer Part Number: CRCW06030000ZSTA; RoHS: No; Category: 厚膜电阻器 - SMD; Stock 1: 44945; Pricing 1: 1=0.110, 10=0.064, 100=0.036, 1000=0.024, 5000=0.010, 10000=0.009, 25000=0.008, 50000=0.006 (USD); RoHS - 贸泽: N; Minimum Order Quantity: 1; Reeling: True; ComponentLink1URL: http://www.mouser.com/ds/2/427/dcrcw-72725.pdf; ComponentLink1Description: http://www.mouser.com/ds/2/427/dcrcw-72725.pdf; Description 1: 厚膜电阻器 - SMD 1/10watt ZEROohm Jumper
R68 = RES: as R96 on sheet 12-LCD背光驱动_BIT3251; Supplier 1: Mouser; Supplier Part Number 1: 71-CRCW0603-22-E3; Manufacturer Part Number: CRCW060322R0FKEA; RoHS: RoHS Compliant By Exemption; Category: 厚膜电阻器 - SMD; Stock 1: 35802; 电阻: 22 Ohms; 容差: 1 %; Minimum Order Quantity: 1; Reeling: True; ComponentLink1URL: http://www.mouser.com/ds/2/427/dcrcwe3-109170.pdf; ComponentLink1Description: http://www.mouser.com/ds/2/427/dcrcwe3-109170.pdf; Description 1: 厚膜电阻器 - SMD 1/10watt 22ohms 1%; Pricing 1: 1=0.080, 10=0.013, 100=0.010, 1000=0.008, 5000=0.005, 25000=0.004, 50000=0.003 (USD); RoHS - 贸泽: E
R69 = RES: as R72 on sheet 06-JTAG; Supplier 1: Mouser; Supplier Part Number 1: 71-CRCW0603-10K-E3; Manufacturer Part Number: CRCW060310K0FKEA; RoHS: RoHS Compliant By Exemption; Category: 厚膜电阻器 - SMD; Stock 1: 0; Pricing 1: 1=0.080, 10=0.013, 100=0.010, 1000=0.008, 5000=0.005, 25000=0.004, 50000=0.003 (USD); 电阻: 10 kOhms; 容差: 1 %; RoHS - 贸泽: E; Minimum Order Quantity: 1; Reeling: True; ComponentLink1URL: http://www.mouser.com/ds/2/427/dcrcwe3-109170.pdf; ComponentLink1Description: http://www.mouser.com/ds/2/427/dcrcwe3-109170.pdf; Description 1: 厚膜电阻器 - SMD 1/10watt 10Kohms 1%
U13 = SPEAKER: 插针 BUZZER MAGNET 2048HZ 12MM PC MNT; Manufacturer: TDK Corporation; Manufacturer Part Number: SD1209T3-A1; Driver Circuitry: Transducer, Externally Driven; Input Type: zero-peak Signal; Voltage - Rated: 3Vo-p; Voltage Range: 1 ~ 4V; Frequency: 2.048kHz; Operating Mode: Continuous; Sound Pressure Level: 89dB @ 3V, 10cm; Current - Supply: 60mA; Washable: No; Supplier 1: Digi-Key; Supplier Part Number 1: 445-2530-ND; RoHS: RoHS Compliant; Description 1: BUZZER MAGNET 2048HZ 12MM PC MNT; Category: Audio Products; Stock 1: 1229; Pricing 1: 1=1.98, 10=1.726, 100=1.0869, 250=1.05496, 500=1.023, 1000=0.9271, 5000=0.83119, 10000=0.81521 (USD); Packaging: Tray; Technology: Magnetic; Mounting Type: Through Hole; Termination: PC Pins; Size / Dimension: Circular - 12.00mm Dia x 9.00mm H; Capacitance @ Frequency: -; Operating Temperature: -40°C ~ 85°C; ComponentLink1URL: http://www.tdk.co.jp/tefe02/ec211_sd.pdf; ComponentLink1Description: http://www.tdk.co.jp/tefe02/ec211_sd.pdf

## Sheet 05-RTC.SchDoc
size A4; DocumentNumber: 26; SheetNumber: 26; SheetTotal: 34
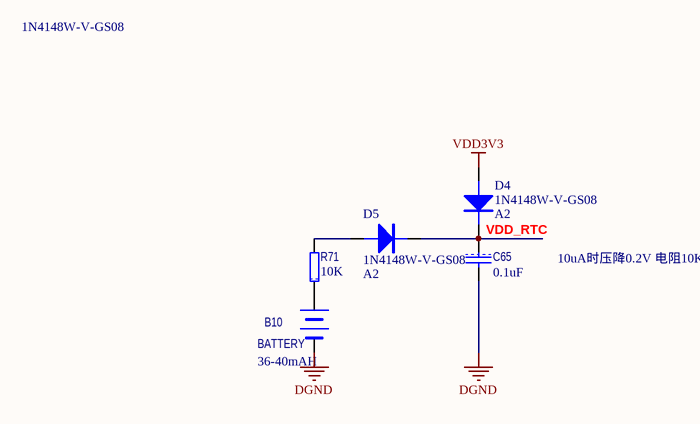
[diagram p9: 05-RTC.SchDoc]

### Parts
B10  BATTERY  volume: 36-40mAH  [BR2032-1GV]
C65  value 0.1uF  [1608[0603]C]  (hidden comment: C1608X7R1H104K)
D4  1N4148W-V-GS08  value A2  [SOD123]
D5  1N4148W-V-GS08  value A2  [SOD123]
R71  value 10K  [1608[0603]R]  (hidden comment: CRCW060310K0FKEA)

### Nets
DGND: B10.2 C65.2
VDD3V3: D4.1(A)
VDD_RTC: C65.1 D4.2(K) D5.2(K)
NetB10_1: B10.1 R71.1
NetD5_1: D5.1(A) R71.2

### Notes on the sheet
- 1N4148W-V-GS08
- 10uA时压降0.2V 电阻10K

### Library data of the parts
B10 = BATTERY: 插针 电池座
C65 = CAP: as C83 on sheet 电源ARM_LP5951_1.3; Category: 多层陶瓷电容器MLCC - SMD/SMT; ComponentLink1Description: http://www.tdk.com/pdf/general_B11.pdf; ComponentLink1URL: http://www.tdk.com/pdf/general_B11.pdf; Description 1: 多层陶瓷电容器MLCC - SMD/SMT 0603 0.1uF 50volts X7R 10%; Manufacturer Part Number: C1608X7R1H104K; Minimum Order Quantity: 1; Pricing 1: 1=0.160, 50=0.070, 100=0.036, 500=0.019, 1000=0.013, 4000=0.010, 8000=0.009, 12000=0.008, 20000=0.007 (USD); Reeling: True; RoHS - 贸泽: Y; RoHS: RoHS Compliant; Stock 1: 224604; Supplier 1: Mouser; Supplier Part Number 1: 810-C1608X7R1H104K; 制造商: TDK; 容差: 10 %; 温度系数/代码: X7R; 电容: 0.1 uF; 端接类型: SMD/SMT
D4 D5 = 1N4148W: as D6 on sheet 06-JTAG; Supplier 1: Mouser; Supplier Part Number 1: 625-1N4148W-V; Manufacturer Part Number: 1N4148W-V-GS08; RoHS: RoHS Compliant; Category: 二极管 - 通用，功率，开关; Stock 1: 404148; Pricing 1: 1=0.090, 10=0.083, 50=0.072, 100=0.068, 500=0.032, 1000=0.026, 3000=0.021, 9000=0.016, 10000=0.016, 18000=0.014 (USD); 峰值反向电压: 100 V; 产品种类: Switching Diodes; RoHS - 贸泽: Y; Minimum Order Quantity: 1; Reeling: True; ComponentLink1URL: http://www.mouser.com/ds/2/427/1n4148w--240387.pdf; ComponentLink1Description: http://www.mouser.com/ds/2/427/1n4148w--240387.pdf; Description 1: 二极管 - 通用，功率，开关 100V Io/150mA
R71 = RES: as R72 on sheet 06-JTAG; Supplier 1: Mouser; Supplier Part Number 1: 71-CRCW0603-10K-E3; Manufacturer Part Number: CRCW060310K0FKEA; RoHS: RoHS Compliant By Exemption; Category: 厚膜电阻器 - SMD; Stock 1: 0; Pricing 1: 1=0.080, 10=0.013, 100=0.010, 1000=0.008, 5000=0.005, 25000=0.004, 50000=0.003 (USD); 电阻: 10 kOhms; 容差: 1 %; RoHS - 贸泽: E; Minimum Order Quantity: 1; Reeling: True; ComponentLink1URL: http://www.mouser.com/ds/2/427/dcrcwe3-109170.pdf; ComponentLink1Description: http://www.mouser.com/ds/2/427/dcrcwe3-109170.pdf; Description 1: 厚膜电阻器 - SMD 1/10watt 10Kohms 1%

## Sheet 03-指示灯.SchDoc
size A4; DocumentNumber: 23; SheetNumber: 23; SheetTotal: 34
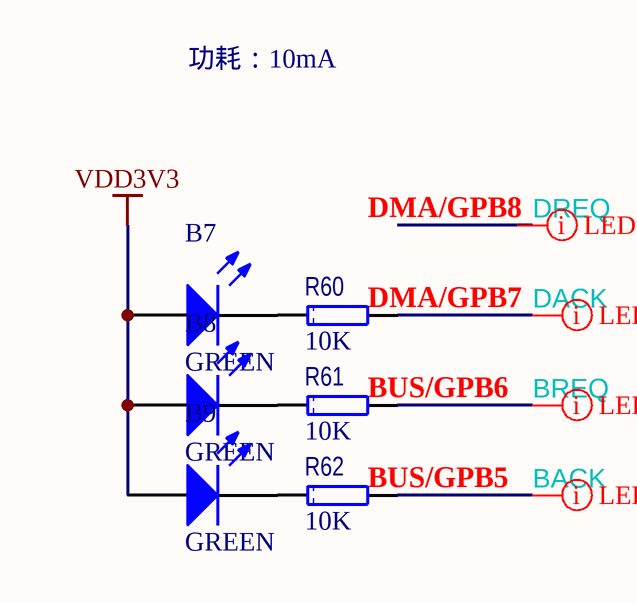
[diagram p10: 03-指示灯.SchDoc]

### Parts
B7  GREEN  [0805LED]
B8  GREEN  [0805LED]
B9  GREEN  [0805LED]
R60  value 10K  [1608[0603]R]  (hidden comment: CRCW060310K0FKEA)
R61  value 10K  [1608[0603]R]  (hidden comment: CRCW060310K0FKEA)
R62  value 10K  [1608[0603]R]  (hidden comment: CRCW060310K0FKEA)

### Nets
VDD3V3: B7.1(A) B8.1(A) B9.1(A)
BACK: R62.2
BREQ: R61.2
DACK: R60.2
NetB7_2: B7.2(K) R60.1
NetB8_2: B8.2(K) R61.1
NetB9_2: B9.2(K) R62.1

### Layout directives
net class LED: BACK, BREQ, DACK, DREQ

### Notes on the sheet
- 功耗：10mA
- (near R60) DMA/GPB7
- (near R60) DMA/GPB8
- (near R62) BUS/GPB5
- (near R61) BUS/GPB6

### Library data of the parts
B7-B9 = LED2: Typical RED, GREEN, YELLOW, AMBER GaAs LED; Published: 8-Jun-2000; LatestRevisionDate: 17-Jul-2002; LatestRevisionNote: Re-released for DXP Platform.; PackageVersion: Feb-2002; PackageReference: 3.2X1.6X1.1; Publisher: Altium Limited; PackageDescription: SM LED; 2 Flat Leads
R60-R62 = RES: as R72 on sheet 06-JTAG; Supplier 1: Mouser; Supplier Part Number 1: 71-CRCW0603-10K-E3; Manufacturer Part Number: CRCW060310K0FKEA; RoHS: RoHS Compliant By Exemption; Category: 厚膜电阻器 - SMD; Stock 1: 0; Pricing 1: 1=0.080, 10=0.013, 100=0.010, 1000=0.008, 5000=0.005, 25000=0.004, 50000=0.003 (USD); 电阻: 10 kOhms; 容差: 1 %; RoHS - 贸泽: E; Minimum Order Quantity: 1; Reeling: True; ComponentLink1URL: http://www.mouser.com/ds/2/427/dcrcwe3-109170.pdf; ComponentLink1Description: http://www.mouser.com/ds/2/427/dcrcwe3-109170.pdf; Description 1: 厚膜电阻器 - SMD 1/10watt 10Kohms 1%

## Sheet 07-LVDS.SchDoc
size A4; DocumentNumber: 28; SheetNumber: 28; SheetTotal: 34
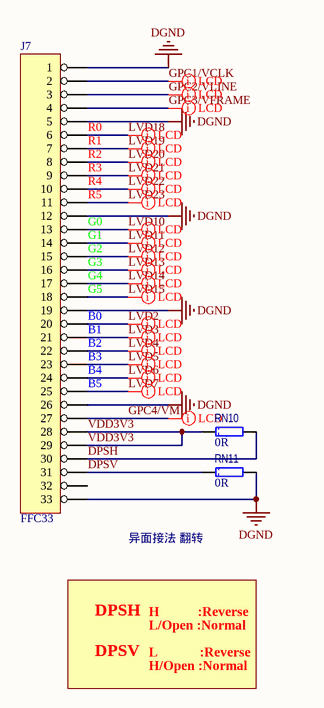
[diagram p11: 07-LVDS.SchDoc]

### Parts
J7  FFC33  [FFC/SM0.5-2H33]
RN10  value 0R  [1608[0603]RN]  (hidden comment: CRCW06030000ZSTA)
RN11  value 0R  [1608[0603]RN]  (hidden comment: CRCW06030000ZSTA)

### Nets
DGND: J7.1 J7.5 J7.12 J7.19 J7.26 J7.33 RN11.2
VDD3V3: J7.28 J7.29 RN10.1
DPSH: J7.30 RN10.2
DPSV: J7.31 RN11.1
GPC1/VCLK: J7.2
GPC2/VLINE: J7.3
GPC3/VFRAME: J7.4
GPC4/VM: J7.27
LVD2: J7.20
LVD3: J7.21
LVD4: J7.22
LVD5: J7.23
LVD6: J7.24
LVD7: J7.25
LVD10: J7.13
LVD11: J7.14
LVD12: J7.15
LVD13: J7.16
LVD14: J7.17
LVD15: J7.18
LVD18: J7.6
LVD19: J7.7
LVD20: J7.8
LVD21: J7.9
LVD22: J7.10
LVD23: J7.11

Not connected (* = marked no-connect by the designer): J7 32

### Layout directives
net class LCD: GPC1/VCLK, GPC2/VLINE, GPC3/VFRAME, GPC4/VM, LVD2, LVD3, LVD4, LVD5, LVD6, LVD7, LVD10, LVD11, LVD12, LVD13, LVD14, LVD15, LVD18, LVD19, LVD20, LVD21, LVD22, LVD23

### Notes on the sheet
- (near J7) R0
- (near J7) R1
- (near J7) R2
- (near J7) R3
- (near J7) R4
- (near J7) R5
- (near J7) G0
- (near J7) G1
- (near J7) G2
- (near J7) G3
- (near J7) G4
- (near J7) G5
- (near J7) B0
- (near J7) B1
- (near J7) B2
- (near J7) B3
- (near J7) B4
- (near J7) B5
- (near J7) 异面接法 翻转
- DPSH
- DPSV
- H           :Reverse
- L/Open :Normal
- L            :Reverse
- H/Open :Normal

### Library data of the parts
J7 = HEADER 33: CON
RN10 RN11 = RES: as R67 on sheet 04-蜂鸣器; Supplier 1: Mouser; Supplier Part Number 1: 71-CRCW0603-0; Manufacturer Part Number: CRCW06030000ZSTA; RoHS: No; Category: 厚膜电阻器 - SMD; Stock 1: 44945; Pricing 1: 1=0.110, 10=0.064, 100=0.036, 1000=0.024, 5000=0.010, 10000=0.009, 25000=0.008, 50000=0.006 (USD); RoHS - 贸泽: N; Minimum Order Quantity: 1; Reeling: True; ComponentLink1URL: http://www.mouser.com/ds/2/427/dcrcw-72725.pdf; ComponentLink1Description: http://www.mouser.com/ds/2/427/dcrcw-72725.pdf; Description 1: 厚膜电阻器 - SMD 1/10watt ZEROohm Jumper